# EasyEDA Pro project _XLR BAL OUT_2026-02-06.epro

# Schematic Schematic1
Board Name: Board1; Create Date: 2024-11-14; Page Name: P1; Project Name: XLR BAL OUT; Schematic Name: Schematic1; Update Date: 2024-11-14; Company: EasyEDA.com; Drawn: EasyEDA; Page Size: A4; Part Number: JLCPCB-002; Reviewed: EasyEDA; Version: V0.1
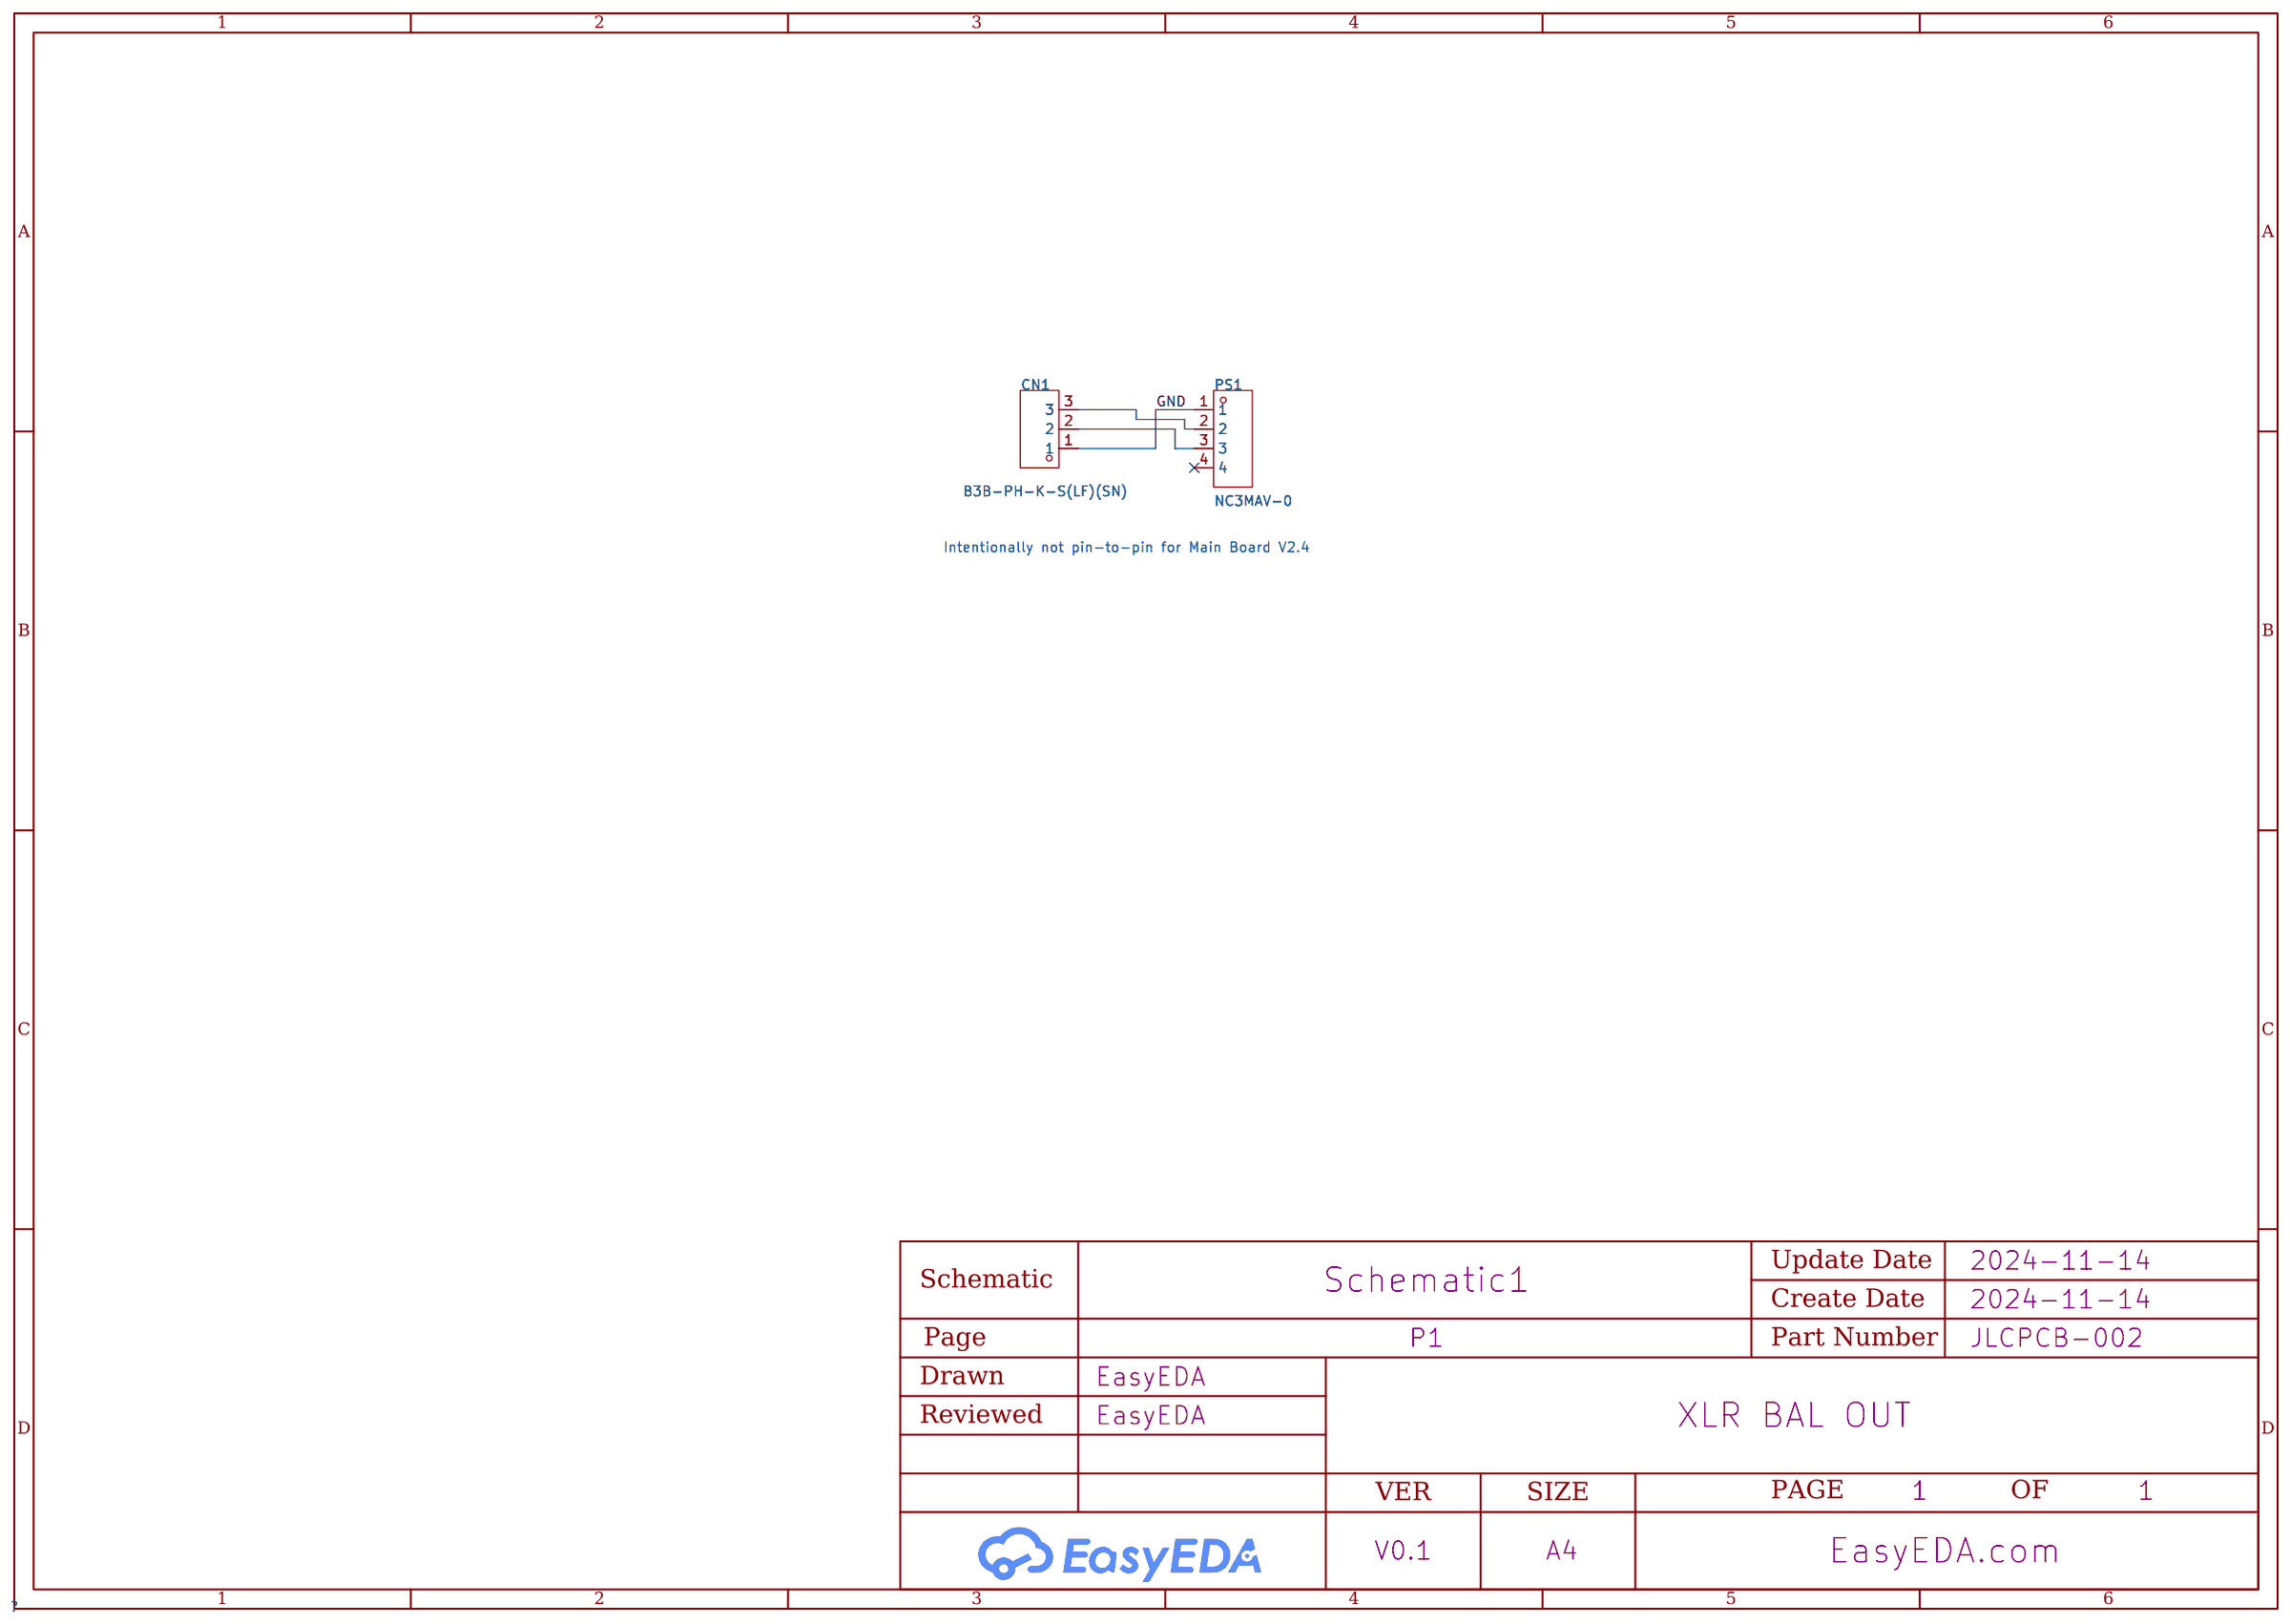
[diagram p0: schematic sheet]

## Parts
CN1  B3B-PH-K-S(LF)(SN)  [CONN-TH_B3B-PH-K-S]
PS1  NC3MAV-0  [CONN-TH_NC3MAV-0]

## Library data of the parts
CN1 = B3B-PH-K-S(LF)(SN): Pins Structure:1x3P Pitch:2mm Mounting Style:Straight Reference Series:PH Number of Pins:3P Number of Rows:1 Number of PINs Per Row:3 Row Spacing:- Current Rating (Max):2A Contact Material:Brass Contact Plating:Tin Operating Temperature Range:-25℃~+85℃ Op; LCSC Part Name: 1x3P 间距:2mm 直插 系列:PH; Supplier Part: C131339; Manufacturer: JST; Supplier Footprint: 插件,P=2mm; JLCPCB Part Class: Extended Part; Datasheet: https://atta.szlcsc.com/upload/public/pdf/source/20171026/C131342_15089839687311058815.pdf; Supplier: LCSC; Pins Structure: 1x3P; Pitch: 2mm; Mounting Style: Straight; Reference Series: PH; Number of Pins: 3P; Number of Rows: 1; Number of PINs Per Row: 3; Current Rating (Max): 2A; Contact Material: Brass; Contact Plating: Tin; Operating Temperature Range: -25℃~+85℃; Rated Voltage (Max): 100V; Plastic Material: PA66; Flame Retardant Rating: UL94V-0; Supplementary Features: 打K脚; Colour: White; Z-Height of the Board: 6mm; X-Length of Bottom Edge on Board (Spacing Line): 7.9mm; Y-Width of Bottom Edge on Board: 4.5mm
PS1 = NC3MAV-0: Supplier Part: C368527; Manufacturer: NEUTRIK(优曲克); Supplier Footprint: 插件; JLCPCB Part Class: Extended Part; Datasheet: https://atta.szlcsc.com/upload/public/pdf/source/20190222/C368527_8DF4BFD61CE9325912172CCCC0CD175D.pdf; Supplier: LCSC

## Nets
GND: CN1.1 PS1.1
$1N328: CN1.2 PS1.3
$1N335: CN1.3 PS1.2

Not connected (* = marked no-connect by the designer): PS1 4*

## Notes on the sheet
- Intentionally not pin-to-pin for Main Board V2.4

# Board PCB1
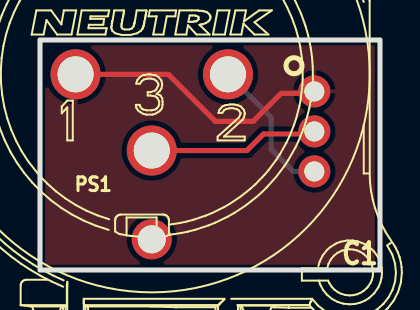
[diagram p1: board, top side]
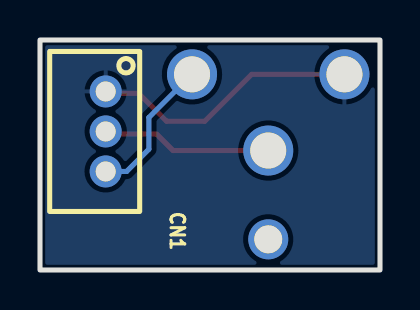
[diagram p2: board, bottom side, seen from below]

Outline 17 x 11.5 mm; copper layers: Top Layer, Bottom Layer. Coordinates in mm from the lower left corner of the outline.
Outline path: rectangle 0,11.5 17,0
Stack: Top Layer 0.035mm / Dielectric1 1.51mm FR4 er 4.5 / Bottom Layer 0.035mm

## Design rules (mm)
template: JLCPCB Capability(Two Layers Board)
spacing copperThickness1oz (default): track to track 0.102, other pairs 0.152 to 0.3
spacing copperThickness2oz: track to track 0.203, other pairs 0.152 to 0.3
track width copperThickness1oz (default): min 0.127, default 0.254, max 2.54
track width copperThickness2oz: min 0.203, default 0.254, max 2.54
differential pair differentialPair (default): width min 0.127, default 0.254, max 2.54; gap min 0.152, default 0.152
via viaSize (default): diameter min 0.5, default 0.61, max 10; hole min 0.3, default 0.305, max 6.3

## Placement (name value [footprint] x y rotation side)
CN1  B3B-PH-K-S(LF)(SN)  [CONN-TH_B3B-PH-K-S]  13.72 6.93 90 bottom
PS1  NC3MAV-0  [CONN-TH_NC3MAV-0]  5.59 5.66 0 top

## Footprints (pads in the part's own frame, mm; a bottom-side part is the same pattern mirrored in y, then rotated)
CONN-TH_B3B-PH-K-S
  round 1.6 hole 1: 1(2,0) 2(0,0) 3(-2,0)
CONN-TH_NC3MAV-0
  round 2.5 hole 1.8: 1(-3.81,4.125) 2(3.81,4.125) 3(0,0.315)
  round 2 hole 1.4: 4(0,-4.125)

## Nets
As in the schematic.

Pads without a net: PS1 4

## Routing (per net, layer and track width the routed paths; a pad name or vN(x,y) marks a point on that pad's centre or on a via; arc(x,y) is an arc through that point)
GND: length 13.5
  Top Layer w0.254: CN1.1 13.62,8.83 12.06,8.83 10.67,7.44 8.76,7.44 6.42,9.78 PS1.1
$1N328: length 8.5
  Top Layer w0.254: CN1.2 13.59,6.8 11.18,6.8 10.35,5.97 PS1.3
$1N335: length 7.3
  Bottom Layer w0.254: CN1.3 12.67,4.93 11.56,6.04 11.56,7.62 PS1.2

## Copper pours and planes (outline as drawn; the poured copper is in the pictures)
GND on Top Layer: 0,11.5 17,11.5 17,0 0,0
GND on Bottom Layer: 0,11.5 17,11.5 17,0 0,0

## Text on the board
Top Silkscreen Layer: C1
